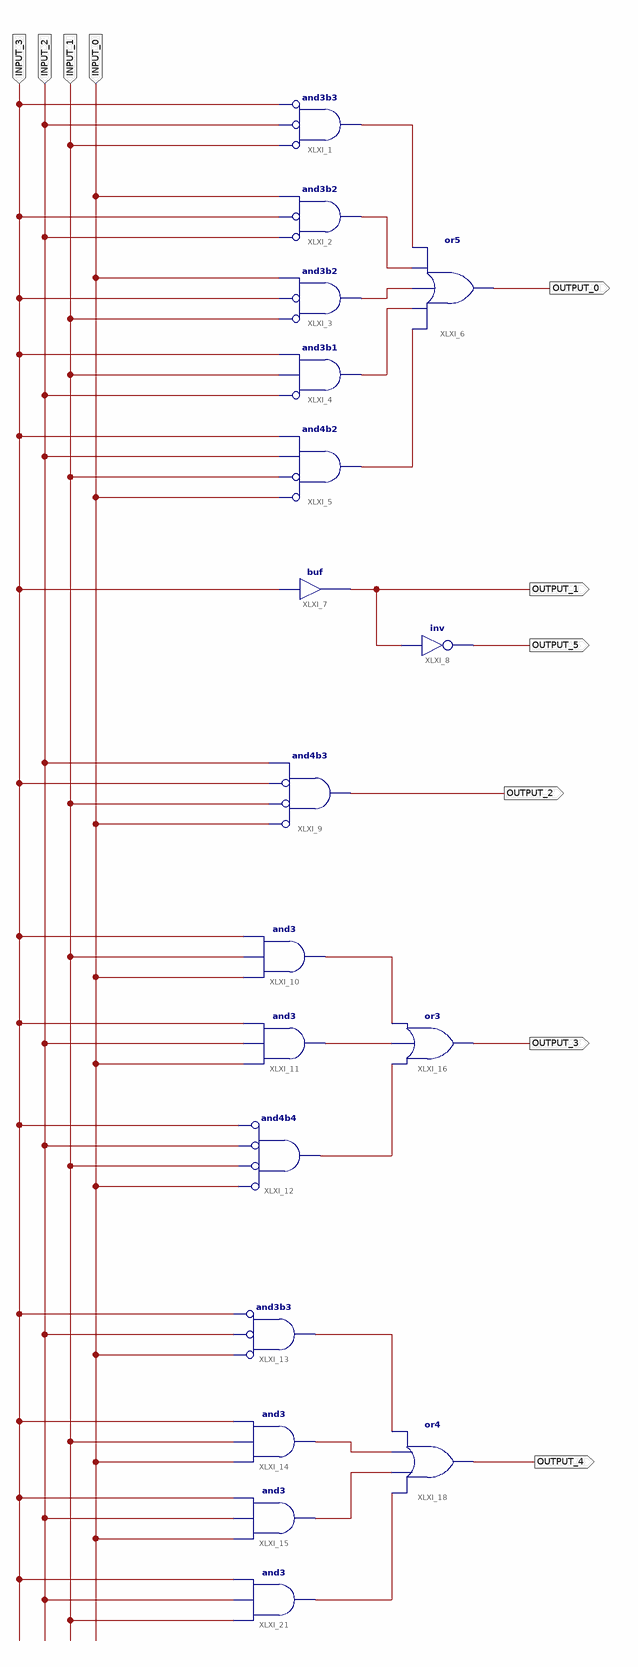
[diagram p0: schematic sheet 1]
// Xilinx ISE schematic SCHEME.sch (spartan3a) as structural Verilog: 18 symbols, 10 ports
module SCHEME (
  input  INPUT_3,
  input  INPUT_2,
  input  INPUT_0,
  input  INPUT_1,
  output OUTPUT_1,
  output OUTPUT_5,
  output OUTPUT_0,
  output OUTPUT_2,
  output OUTPUT_3,
  output OUTPUT_4
);

  wire XLXN_5, XLXN_6, XLXN_7, XLXN_8, XLXN_9, XLXN_10, XLXN_11, XLXN_12, XLXN_13, XLXN_14, XLXN_15, XLXN_16;

  and XLXI_1 (XLXN_5, ~INPUT_1, ~INPUT_2, ~INPUT_3);  // and3b3
  and XLXI_2 (XLXN_6, ~INPUT_2, ~INPUT_3, INPUT_0);  // and3b2
  and XLXI_3 (XLXN_7, ~INPUT_1, ~INPUT_3, INPUT_0);  // and3b2
  and XLXI_4 (XLXN_8, ~INPUT_2, INPUT_1, INPUT_3);  // and3b1
  and XLXI_5 (XLXN_9, ~INPUT_0, ~INPUT_1, INPUT_2, INPUT_3);  // and4b2
  or XLXI_6 (OUTPUT_0, XLXN_9, XLXN_8, XLXN_7, XLXN_6, XLXN_5);
  and XLXI_10 (XLXN_10, INPUT_0, INPUT_1, INPUT_3);
  and XLXI_11 (XLXN_11, INPUT_0, INPUT_2, INPUT_3);
  and XLXI_12 (XLXN_12, ~INPUT_0, ~INPUT_1, ~INPUT_2, ~INPUT_3);  // and4b4
  or XLXI_16 (OUTPUT_3, XLXN_12, XLXN_11, XLXN_10);
  buf XLXI_7 (OUTPUT_1, INPUT_3);
  not XLXI_8 (OUTPUT_5, OUTPUT_1);
  and XLXI_9 (OUTPUT_2, ~INPUT_0, ~INPUT_1, ~INPUT_3, INPUT_2);  // and4b3
  or XLXI_18 (OUTPUT_4, XLXN_16, XLXN_15, XLXN_14, XLXN_13);
  and XLXI_21 (XLXN_16, INPUT_1, INPUT_2, INPUT_3);
  and XLXI_15 (XLXN_15, INPUT_0, INPUT_2, INPUT_3);
  and XLXI_14 (XLXN_14, INPUT_0, INPUT_1, INPUT_3);
  and XLXI_13 (XLXN_13, ~INPUT_0, ~INPUT_2, ~INPUT_3);  // and3b3
endmodule
